# Altium schematic sheet 30-172 - SM Clock Ethernet Module.SchDoc
size A4
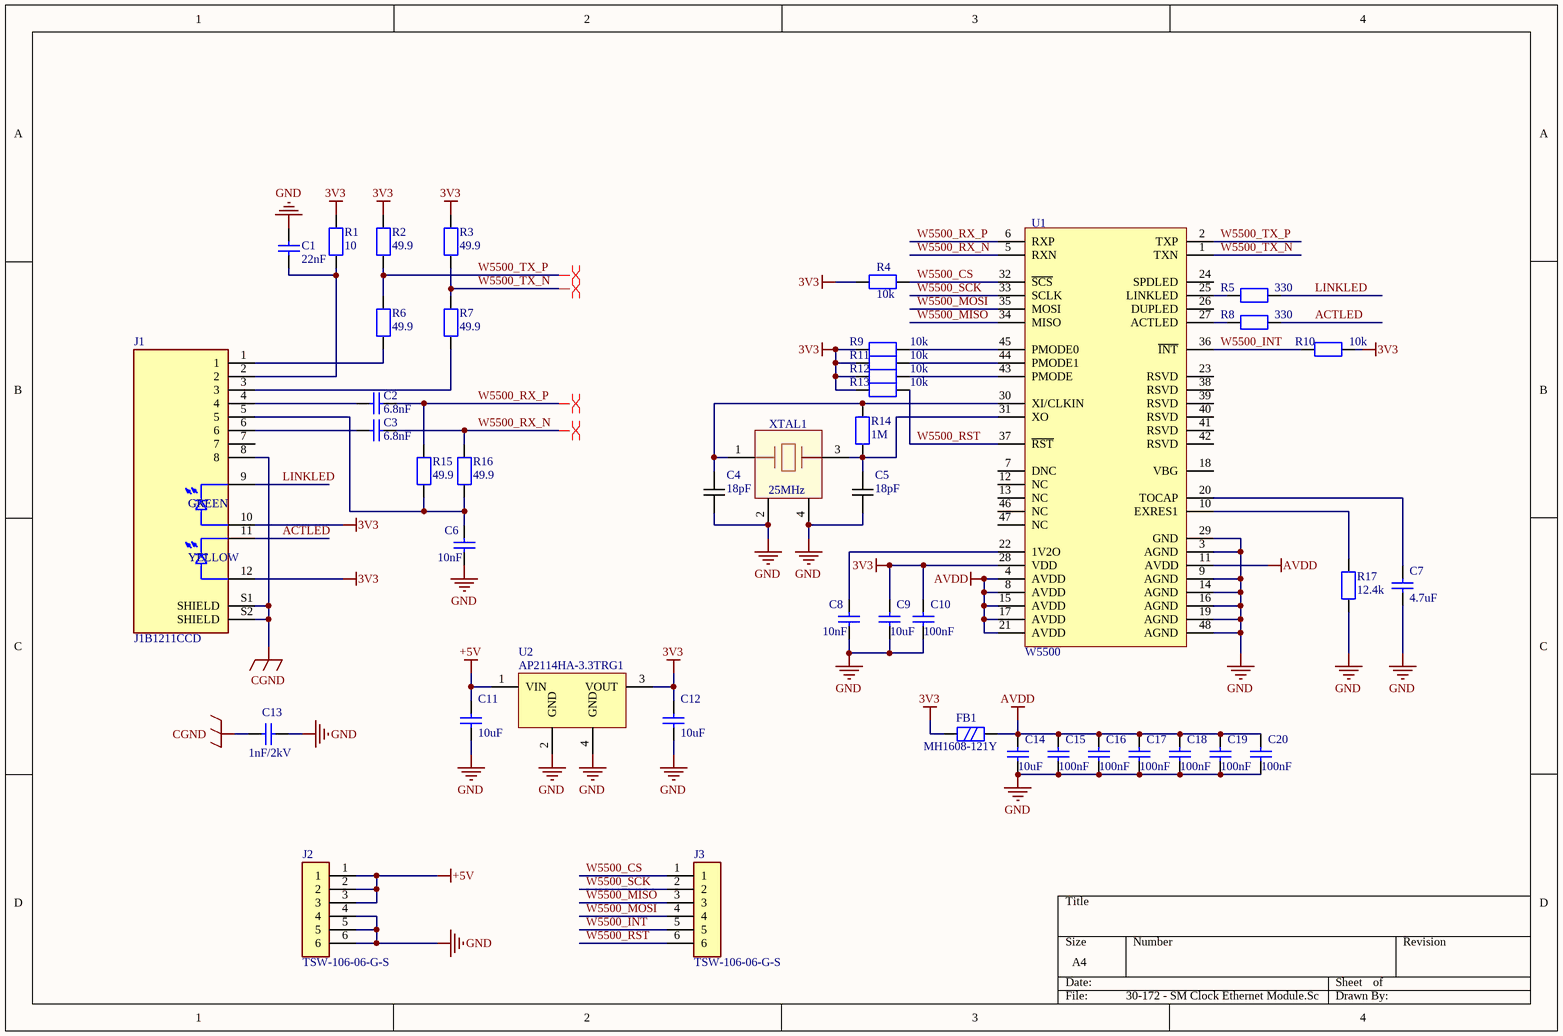
[diagram p0: 30-172 - SM Clock Ethernet Module.SchDoc]

## Parts
C1  22nF  [C0603]
C2  6.8nF  [C0603]
C3  6.8nF  [C0603]
C4  18pF  [C0603]
C5  18pF  [C0603]
C6  10nF  [C0603]
C7  4.7uF  [C0805]
C8  10nF  [C0603]
C9  10uF  [C0805]
C10  100nF  [C0603]
C11  10uF  [C0805]
C12  10uF  [C0805]
C13  1nF/2kV  [C1206]
C14  10uF  [C0805]
C15  100nF  [C0603]
C16  100nF  [C0603]
C17  100nF  [C0603]
C18  100nF  [C0603]
C19  100nF  [C0603]
C20  100nF  [C0603]
FB1  MH1608-121Y  [L0603]
J1  J1B1211CCD  [J1B1211CCD]
J2  TSW-106-06-G-S  [TSW-106-06-G-S]
J3  TSW-106-06-G-S  [TSW-106-06-G-S]
R1  10  [R0603]
R2  49.9  [R0603]
R3  49.9  [R0603]
R4  10k  [R0603]
R5  330  [R0603]
R6  49.9  [R0603]
R7  49.9  [R0603]
R8  330  [R0603]
R9  10k  [R0603]
R10  10k  [R0603]
R11  10k  [R0603]
R12  10k  [R0603]
R13  10k  [R0603]
R14  1M  [R0603]
R15  49.9  [R0603]
R16  49.9  [R0603]
R17  12.4k  [R0603]
U1  W5500  [LQFP-48]
U2  AP2114HA-3.3TRG1  [SOT223-3]
XTAL1  25MHz  [ECS2501836B2CTYTR]

## Nets
3V3: C9.2 C10.2 C12.2 FB1.1 J1.10 J1.12 R1.2 R2.2 R3.2 R4.2 R9.2 R10.2 R11.2 R12.2 R13.2 U1.28(VDD) U2.3(VOUT)
+5V: C11.2 J2.1 J2.2 J2.3 U2.1(VIN)
AVDD: C14.2 C15.2 C16.2 C17.2 C18.2 C19.2 C20.2 FB1.2 U1.4(AVDD) U1.8(AVDD) U1.11(AVDD) U1.15(AVDD) U1.17(AVDD) U1.21(AVDD)
CGND: C13.1 J1.8 J1.S1(SHIELD) J1.S2(SHIELD)
GND: C1.2 C4.1 C5.1 C6.1 C7.1 C8.1 C9.1 C10.1 C11.1 C12.1 C13.2 C14.1 C15.1 C16.1 C17.1 C18.1 C19.1 C20.1 J2.4 J2.5 J2.6 R17.1 U1.3(AGND) U1.9(AGND) U1.14(AGND) U1.16(AGND) U1.19(AGND) U1.29(GND) U1.48(AGND) U2.2(GND) U2.4(GND) XTAL1.2 XTAL1.4
ACTLED: J1.11 R8.2
LINKLED: J1.9 R5.2
W5500_CS: J3.1 R4.1 U1.32(~{SCS})
W5500_INT: J3.5 R10.1 U1.36(~{INT})
W5500_MISO: J3.3 U1.34(MISO)
W5500_MOSI: J3.4 U1.35(MOSI)
W5500_RST: J3.6 R13.1 U1.37(~{RST})
W5500_RX_N: C3.2 R16.2 U1.5(RXN)
W5500_RX_P: C2.2 R15.2 U1.6(RXP)
W5500_SCK: J3.2 U1.33(SCLK)
W5500_TX_N: R3.1 R7.2 U1.1(TXN)
W5500_TX_P: R2.1 R6.2 U1.2(TXP)
NetC1_1: C1.1 J1.2 R1.1
NetC2_1: C2.1 J1.4
NetC3_1: C3.1 J1.6
NetC4_2: C4.2 R14.2 U1.30(XI/CLKIN) XTAL1.1
NetC5_2: C5.2 R14.1 U1.31(XO) XTAL1.3
NetC6_2: C6.2 J1.5 R15.1 R16.1
NetC7_2: C7.2 U1.20(TOCAP)
NetC8_2: C8.2 U1.22(1V2O)
NetJ1_1: J1.1 R6.1
NetJ1_3: J1.3 R7.1
NetR5_1: R5.1 U1.25(LINKLED)
NetR8_1: R8.1 U1.27(ACTLED)
NetR9_1: R9.1 U1.45(PMODE0)
NetR11_1: R11.1 U1.44(PMODE1)
NetR12_1: R12.1 U1.43(PMODE)
NetR17_2: R17.2 U1.10(EXRES1)

Not connected (* = marked no-connect by the designer): J1 7; U1 7(DNC) 12(NC) 13(NC) 18(VBG) 23(RSVD) 24(SPDLED) 26(DUPLED) 38(RSVD) 39(RSVD) 40(RSVD) 41(RSVD) 42(RSVD) 46(NC) 47(NC)

## Layout directives
differential pair: W5500_RX_N, W5500_RX_P, W5500_TX_N, W5500_TX_P

## Notes on the sheet
- (in symbol J1B1211CCD) GREEN; YELLOW

## Library data of the parts
C1 = 22nF ± 10% 50V: Manufacturer: Yageo; Manufacturer Part Number: CC0603KRX7R9BB223; Value: 22nF; Supplier: Mouser; Supplier Part Number: 603-CC603KRX7R9BB223; Price: 0.1
C2 C3 = 6.8nF ± 10% 50V: Manufacturer: Yageo; Manufacturer Part Number: CC0603KPX7R9BB682; Value: 6.8nF; Supplier: Mouser; Supplier Part Number: 603-CC0603KPX7R9BB682; Price: 0.1
C4 C5 = 18pF 50V 0603 X7R: Manufacturer: Yageo; Manufacturer Part Number: CC0603FRNPO9BN180; Value: 18pF; Supplier: Mouser; Supplier Part Number: 603-CC603FRNPO9BN180
C6 C8 = 10nF ± 10% 50V: Manufacturer: Yageo; Manufacturer Part Number: CC0603KRX7R9BB103; Value: 10nF; Supplier: Mouser; Supplier Part Number: 603-CC603KRX7R9BB103; Price: 0.1
C7 = 4.7uF ± 10% 25V: Manufacturer: Yageo; Manufacturer Part Number: CC0805KKX7R8BB475; Value: 4.7uF; Supplier: Mouser; Supplier Part Number: 603-CC0805KKX7R8BB475; Price: 0.31
C9 C11 C12 C14 = 10uF ± 10% 16V: Manufacturer: Yageo; Manufacturer Part Number: CC0805KKX5R7BB106; Value: 10uF; Supplier: Mouser; Supplier Part Number: 603-CC0805KKX5R7BB106; Price: 0.3
C10 C15-C20 = 100nF ± 10% 50V: Manufacturer: Yageo; Manufacturer Part Number: CC0603KRX7R9BB104; Value: 100nF; Supplier: Mouser; Supplier Part Number: 603-CC603KRX7R9BB104; Price: 0.1
C13 = 1nF ± 10% 2kV: Manufacturer: Yageo; Manufacturer Part Number: CC1206KKX7RDBB102; Value: 1nF/2kV; Supplier: Mouser; Supplier Part Number: 603-CC206KKX7RDBB102; Price: 0.3
FB1 = MH1608-121Y: Ferrite Beads 120 ohms 25% HIGH CURRENT; Manufacturer: Bourns; Value: MH1608-121Y; Manufacturer Part Number: MH1608-121Y; Supplier: Mouser; Supplier Part Number: 652-MH1608-121Y; Price: 0.1
J1 = J1B1211CCD: Modular Connectors / Ethernet Connectors RJ-45 w/ Transformer Connector /CETUS; Manufacturer: WIZnet; Manufacturer Part Number: J1B1211CCD; Price: 4.8; Supplier: Mouser; Value: J1B1211CCD; Supplier Part Number: 950-J1B1211CCD
J2 J3 = TSW-106-06-G-S: Headers & Wire Housings Classic PCB Header Strips, 0.100" pitch; Manufacturer: Samtec; Supplier Part Number: TSW-106-06-G-S; Price: 1.03; Manufacturer Part Number: TSW-106-06-G-S; Value: TSW-106-06-G-S; Supplier: Mouser
R1 = 10 Ohms ±1% 0.1W: Manufacturer: Yageo; Manufacturer Part Number: RC0603FR-0710RL; Value: 10; Supplier: Mouser; Supplier Part Number: 603-RC0603FR-0710RL; Price: 0.1
R2 R3 R6 R7 R15 R16 = 49.9 Ohms ±1% 0.1W: Manufacturer: Yageo; Manufacturer Part Number: RC0603FR-0749R9L; Value: 49.9; Supplier: Mouser; Supplier Part Number: 603-RC0603FR-0749R9L; Price: 0.1
R4 R9-R13 = 10 kOhms ±1% 0.1W: Manufacturer: Yageo; Manufacturer Part Number: RC0603FR-0710KL; Value: 10k; Supplier: Mouser; Supplier Part Number: 603-RC0603FR-0710KL; Price: 0.1
R5 R8 = 330 Ohms ±1% 0.1W: Manufacturer: Yageo; Manufacturer Part Number: RC0603FR-07330RL; Value: 330; Supplier: Mouser; Supplier Part Number: 603-RC0603FR-07330RL; Price: 0.1
R14 = 1 MOhms ±1% 0.1W: Manufacturer: Yageo; Manufacturer Part Number: RC0603FR-071ML; Value: 1M; Supplier: Mouser; Supplier Part Number: 603-RC0603FR-071ML; Price: 0.1
R17 = 12.4 kOhms ±1% 0.1W: Manufacturer: Yageo; Manufacturer Part Number: RC0603FR-0712K4L; Value: 12.4k; Supplier: Mouser; Supplier Part Number: 603-RC0603FR-0712K4L
U1 = W5500: Ethernet ICs 3in1 Enet Controller TCP/IP +MAC+PHY; Manufacturer: WIZnet; Supplier Part Number: 950-W5500; Value: W5500; Supplier: Mouser; Price: 3.5; Manufacturer Part Number: W5500
U2 = AP2114HA-3.3TRG1: LDO Voltage Regulators 1A LN CMOS LDO 0.45V 60uA 50mA; Manufacturer: Diodes Inc.; Supplier Part Number: 621-AP2114HA-3.3TRG1; Price: 0.37; Manufacturer Part Number: AP2114HA-3.3TRG1; Value: AP2114HA-3.3TRG1; Supplier: Mouser
XTAL1 = ECS-250-18-36B2-CTY-TR: Crystals ESR 50,FREQ 25,STABILITY +/-30ppm,TOLERANCE +/-10ppm,CL 18pF,AGING +/-2 ppm ,-30 C 85 C,100uW in typical (Max 200uW), 2.50mm x 2.00mm; Manufacturer: ECS; Supplier Part Number: 520-250-18-36B2CTYTR; Value: 25MHz; Price: 0.4; Supplier: Mouser; Manufacturer Part Number: ECS-250-18-36B2-CTY-TR